# Altium schematic sheet HDMI.SchDoc
size Letter
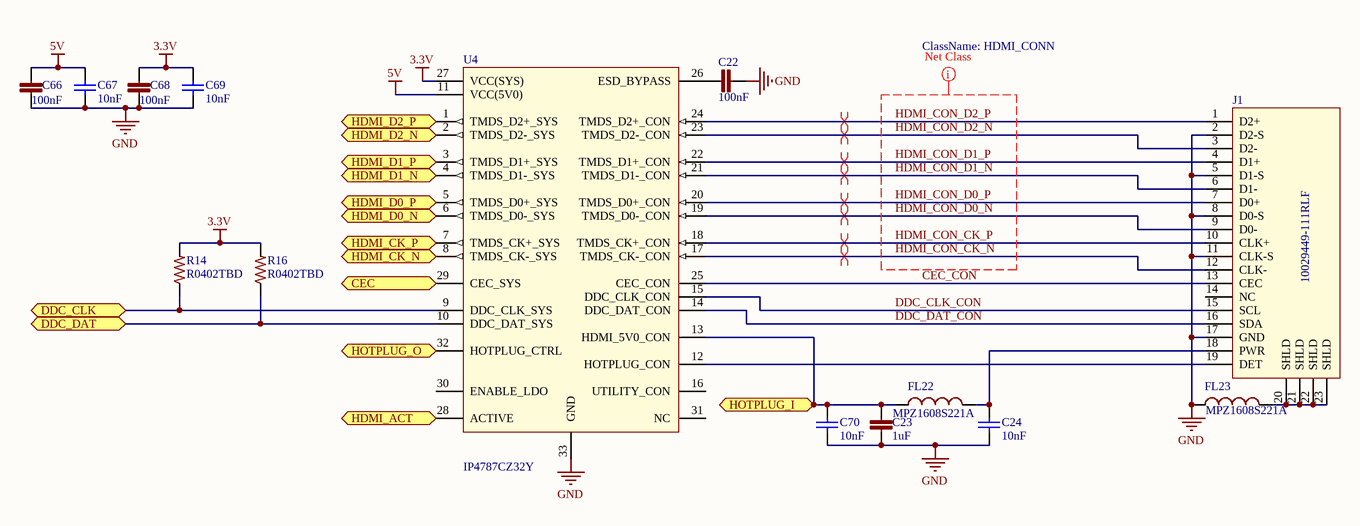
[diagram p0: HDMI.SchDoc]

## Parts
C22  100nF  [C0402]
C23  1uF  [C0402]
C24  10nF  [C0402]
C66  100nF  [C0402]
C67  10nF  [C0402]
C68  100nF  [C0402]
C69  10nF  [C0402]
C70  10nF  [C0402]
FL22  MPZ1608S221A  [C0603]
FL23  MPZ1608S221A  [C0603]
J1  10029449-111RLF  [10029449-111RLF]
R14  R0402TBD  [R0402]
R16  R0402TBD  [R0402]
U4  IP4787CZ32Y  [QFN32-HVQFN32]

## Ports
CEC, DDC_CLK, DDC_DAT, HDMI_ACT, HDMI_CK_N, HDMI_CK_P, HDMI_D0_N, HDMI_D0_P, HDMI_D1_N, HDMI_D1_P, HDMI_D2_N, HDMI_D2_P, HOTPLUG_I, HOTPLUG_O

## Nets
3.3V: C68.1 C69.2 R14.2 R16.2 U4.27(VCC(SYS))
5V: C66.1 C67.2 U4.11(VCC(5V0))
GND: C22.2 C23.2 C24.1 C66.2 C67.1 C68.2 C69.1 C70.1 FL23.1 J1.2(D2-S) J1.5(D1-S) J1.8(D0-S) J1.11(CLK-S) J1.17(GND) U4.33(GND)
CEC: U4.29(CEC_SYS) ; port CEC
CEC_CON: J1.13(CEC) U4.25(CEC_CON)
DDC_CLK: R14.1 U4.9(DDC_CLK_SYS) ; port DDC_CLK
DDC_CLK_CON: J1.15(SCL) U4.15(DDC_CLK_CON)
DDC_DAT: R16.1 U4.10(DDC_DAT_SYS) ; port DDC_DAT
DDC_DAT_CON: J1.16(SDA) U4.14(DDC_DAT_CON)
HDMI_ACT: U4.28(ACTIVE) ; port HDMI_ACT
HDMI_CK_N: U4.8(TMDS_CK-_SYS) ; port HDMI_CK_N
HDMI_CK_P: U4.7(TMDS_CK+_SYS) ; port HDMI_CK_P
HDMI_CON_CK_N: J1.12(CLK-) U4.17(TMDS_CK-_CON)
HDMI_CON_CK_P: J1.10(CLK+) U4.18(TMDS_CK+_CON)
HDMI_CON_D0_N: J1.9(D0-) U4.19(TMDS_D0-_CON)
HDMI_CON_D0_P: J1.7(D0+) U4.20(TMDS_D0+_CON)
HDMI_CON_D1_N: J1.6(D1-) U4.21(TMDS_D1-_CON)
HDMI_CON_D1_P: J1.4(D1+) U4.22(TMDS_D1+_CON)
HDMI_CON_D2_N: J1.3(D2-) U4.23(TMDS_D2-_CON)
HDMI_CON_D2_P: J1.1(D2+) U4.24(TMDS_D2+_CON)
HDMI_D0_N: U4.6(TMDS_D0-_SYS) ; port HDMI_D0_N
HDMI_D0_P: U4.5(TMDS_D0+_SYS) ; port HDMI_D0_P
HDMI_D1_N: U4.4(TMDS_D1-_SYS) ; port HDMI_D1_N
HDMI_D1_P: U4.3(TMDS_D1+_SYS) ; port HDMI_D1_P
HDMI_D2_N: U4.2(TMDS_D2-_SYS) ; port HDMI_D2_N
HDMI_D2_P: U4.1(TMDS_D2+_SYS) ; port HDMI_D2_P
HOTPLUG_I: C23.1 C70.2 FL22.1 U4.13(HDMI_5V0_CON) ; port HOTPLUG_I
HOTPLUG_O: U4.32(HOTPLUG_CTRL) ; port HOTPLUG_O
NetC22_1: C22.1 U4.26(ESD_BYPASS)
NetC24_2: C24.2 FL22.2 J1.18(PWR)
NetFL23_2: FL23.2 J1.20(SHLD) J1.21(SHLD) J1.22(SHLD) J1.23(SHLD)
NetJ1_19: J1.19(DET) U4.12(HOTPLUG_CON)

Not connected (* = marked no-connect by the designer): J1 14(NC); U4 16(UTILITY_CON) 30(ENABLE_LDO) 31(NC)

## Layout directives
net class HDMI_CONN: HDMI_CON_CK_N, HDMI_CON_CK_P, HDMI_CON_D0_N, HDMI_CON_D0_P, HDMI_CON_D1_N, HDMI_CON_D1_P, HDMI_CON_D2_N, HDMI_CON_D2_P
differential pair: HDMI_CON_CK_N, HDMI_CON_CK_P, HDMI_CON_D0_N, HDMI_CON_D0_P, HDMI_CON_D1_N, HDMI_CON_D1_P, HDMI_CON_D2_N, HDMI_CON_D2_P

## Library data of the parts
C22 C66 C68 = GRM155R71C104KA88D: CAP CER 0402 100nF 16V 10% X7R; LastRevisionNote: ImportComponents; Published: 23-Apr-2014; Publisher: UltiMachine; LastRevisionDate: 23-Apr-2014; ManufacturerPartNumber: GRM155R71C104KA88D; VALUE: 100nF
C23 = GRM155R60J105KE19D: CAP CER 0402 1uF 6.3V 10% X5R; LastRevisionNote: ImportComponents; Published: 23-Apr-2014; Publisher: UltiMachine; LastRevisionDate: 23-Apr-2014; ManufacturerPartNumber: GRM155R60J105KE19D; VALUE: 1uF
C24 C67 C69 C70 = GRM155R71H103JA88D: CAP CER 10nF 50V X7R 0402; MFR: Murata; Part Description: CAP CER 10000PF 50V X7R 0402; Tolerance: 10%; Voltage: 6.3VDC; Value: 0.01uF 50V; Published: 10 - Dec - 2014; LatestRevisionDate: 10 - Dec - 2014; LatestRevisionNote: Ultimachine Footprint Added; Publisher: Ultimachine; Component Type: Chip Capacitor; MFR Part #: GRM155R71H103JA88D; Mounting Type: SMT 0402; Datasheet: http://search.murata.co.jp/Ceramy/image/img/A01X/G101/ENG/GRM155R71H103JA88-01.pdf; Height: 0.5 ±0.05mm; Digikey #: 490-7763-1-ND; PackageReference: 0402
FL22 FL23 = MPZ1608S221A: Ferrite; LastRevisionNote: ImportComponents; Published: 23-Apr-2014; Publisher: UltiMachine; LastRevisionDate: 23-Apr-2014; Value: MPZ1608S221A
J1 = 10029449-111RLF: CONN HDMI RECPT 19POS SMT R/A
R14 R16 = R0402TBD: Resistor; LastRevisionNote: ImportComponents; Published: 23-Apr-2014; Publisher: UltiMachine; LastRevisionDate: 23-Apr-2014; VALUE: R0402TBD
U4 = IP4787CZ32Y: IC DVI/HDMI ESD PROTECT 32HVQFN